# EAGLE schematic main (EAGLE 6.5.0)
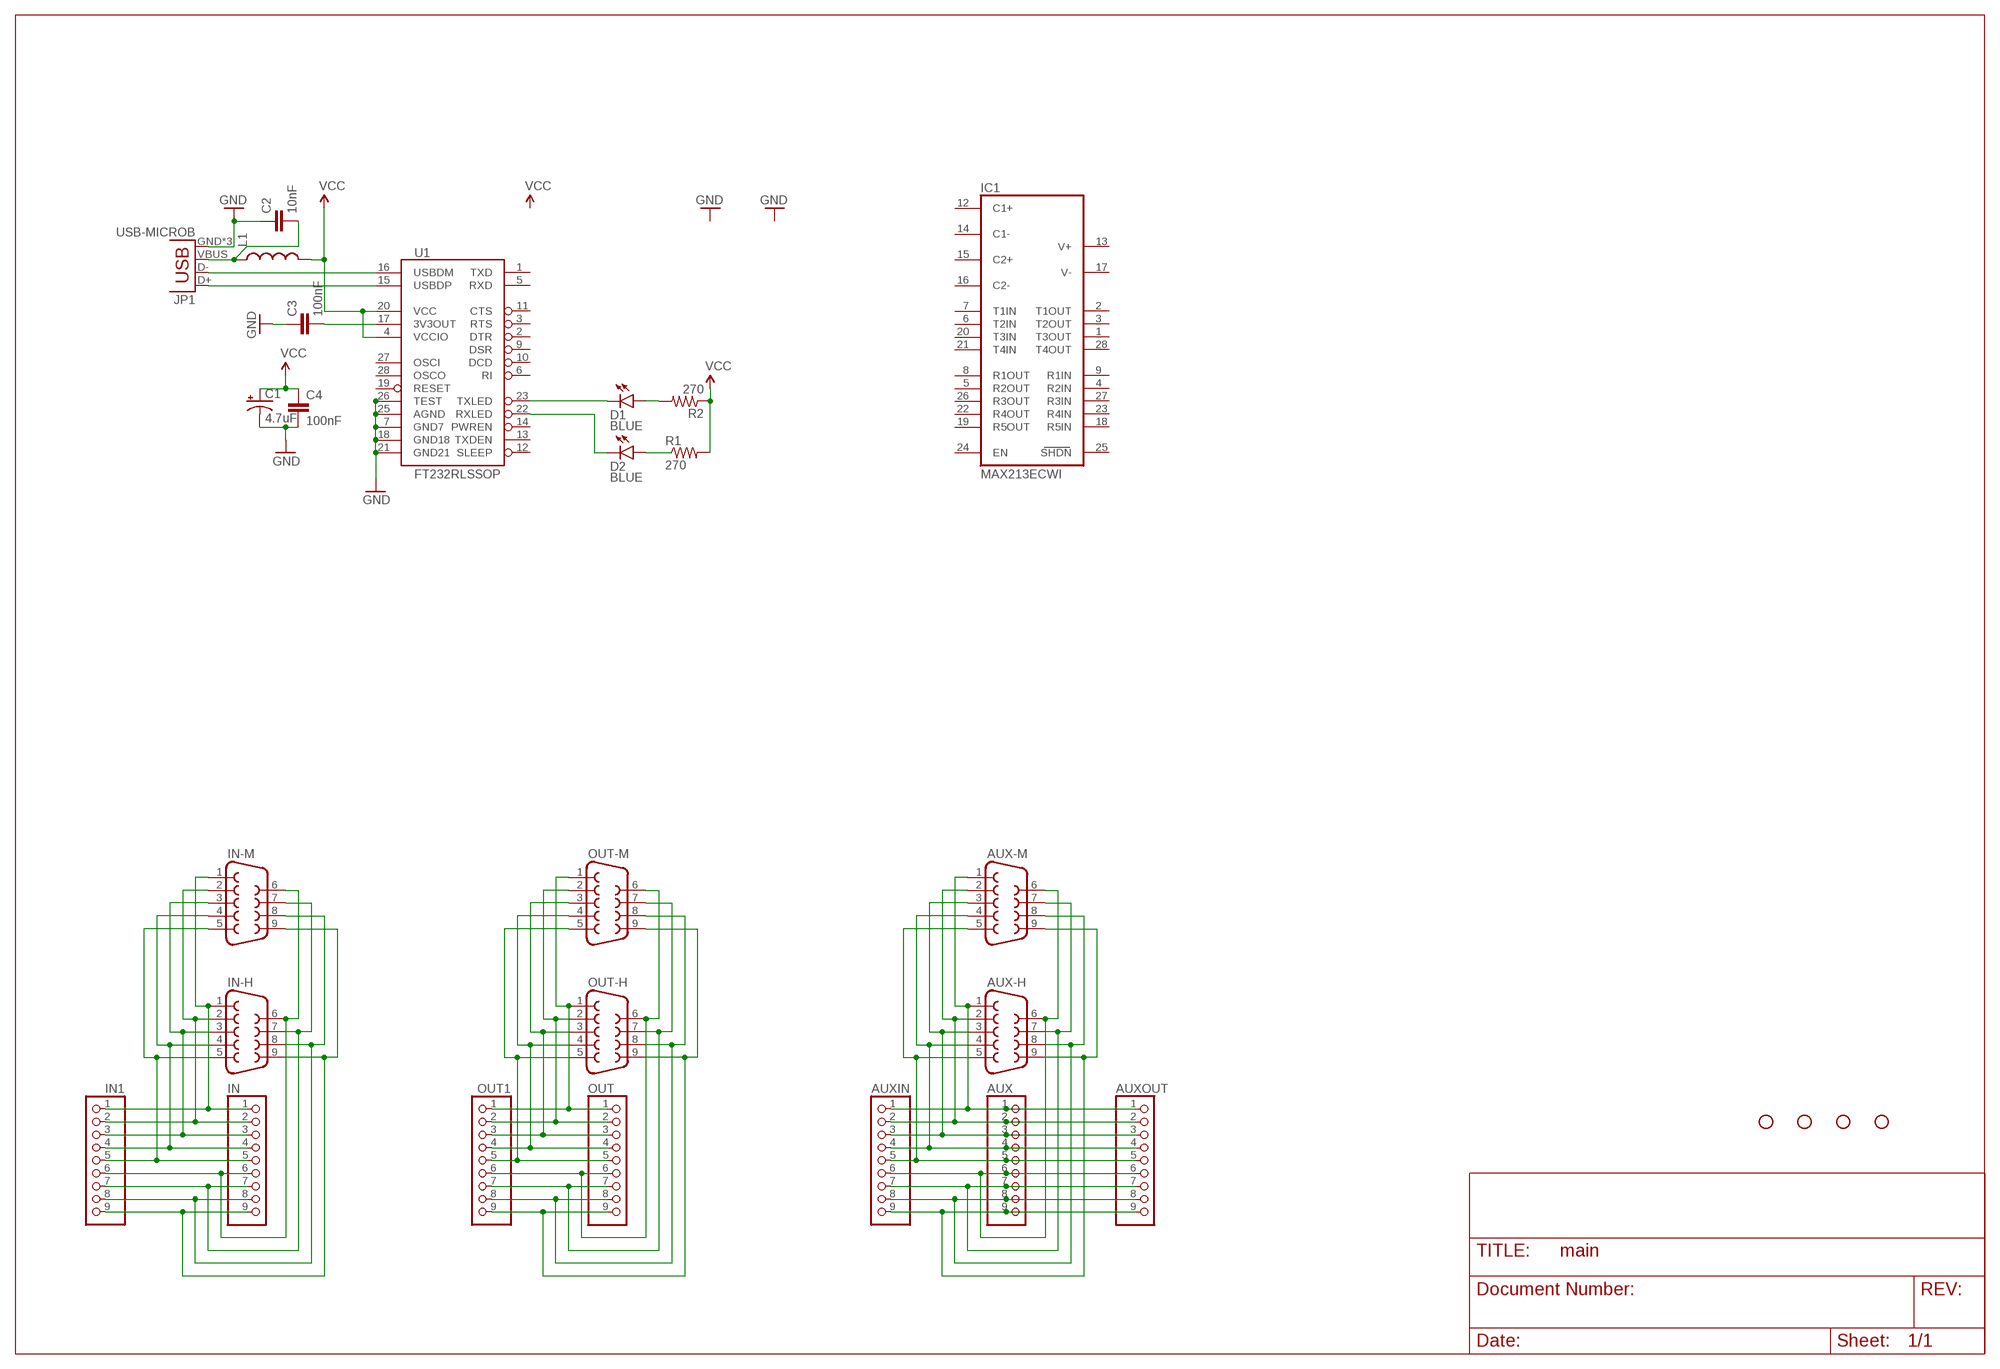
[diagram p0: schematic, sheet 1]

## Parts
AUX  PINHD-1X9  [1X09]
AUX-H  F09HP  [F09HP]
AUX-M  F09HP  [F09HP]
AUXIN  PINHD-1X9  [1X09]
AUXOUT  PINHD-1X9  [1X09]
C1  4.7uF  CAP_POL1206  [EIA3216]
C2  10nF  CAP0603-CAP  [0603-CAP]
C3  100nF  CAP0603-CAP  [0603-CAP]
C4  100nF  CAP0603-CAP  [0603-CAP]
D1  BLUE  LED-BLUE0603  [LED-0603]
D2  BLUE  LED-BLUE0603  [LED-0603]
IC1  MAX213ECWI  [SO28L]
IN  PINHD-1X9  [1X09]
IN1  PINHD-1X9  [1X09]
IN-H  F09HP  [F09HP]
IN-M  F09HP  [F09HP]
JP1  USB-MICROB  [USB-MICROB]
L1  INDUCTOR0603  [0603]
OUT  PINHD-1X9  [1X09]
OUT1  PINHD-1X9  [1X09]
OUT-H  F09HP  [F09HP]
OUT-M  F09HP  [F09HP]
R1  270  RESISTOR0603  [0603-RES]
R2  270  RESISTOR0603  [0603-RES]
STANDOFF1  STAND-OFF  [STAND-OFF]
STANDOFF2  STAND-OFF  [STAND-OFF]
STANDOFF3  STAND-OFF  [STAND-OFF]
STANDOFF4  STAND-OFF  [STAND-OFF]
U1  FT232RLSSOP  [SSOP28DB]

## Nets
GND: C1.C(-) C2.1 C3.1 C4.2 JP1.GND JP1.MT1(GND) JP1.MT2(GND) U1.7(GND7) U1.18(GND18) U1.21(GND21) U1.25(AGND) U1.26(TEST)
N$1: IN1.1 IN-H.1 IN-M.1 IN.1
N$2: IN1.2 IN-H.2 IN-M.2 IN.2
N$3: IN1.3 IN-H.3 IN-M.3 IN.3
N$4: IN1.4 IN-H.4 IN-M.4 IN.4
N$5: IN1.5 IN-H.5 IN-M.5 IN.5
N$6: IN1.6 IN-H.6 IN-M.6 IN.6
N$7: IN1.7 IN-H.7 IN-M.7 IN.7
N$8: IN1.8 IN-H.8 IN-M.8 IN.8
N$9: IN1.9 IN-H.9 IN-M.9 IN.9
N$10: OUT1.1 OUT-H.1 OUT-M.1 OUT.1
N$11: OUT1.2 OUT-H.2 OUT-M.2 OUT.2
N$12: OUT1.3 OUT-H.3 OUT-M.3 OUT.3
N$13: OUT1.4 OUT-H.4 OUT-M.4 OUT.4
N$14: OUT1.5 OUT-H.5 OUT-M.5 OUT.5
N$15: OUT1.6 OUT-H.6 OUT-M.6 OUT.6
N$16: OUT1.7 OUT-H.7 OUT-M.7 OUT.7
N$17: OUT1.8 OUT-H.8 OUT-M.8 OUT.8
N$18: OUT1.9 OUT-H.9 OUT-M.9 OUT.9
N$19: AUX-H.1 AUX-M.1 AUX.1 AUXIN.1 AUXOUT.1
N$20: AUX-H.2 AUX-M.2 AUX.2 AUXIN.2 AUXOUT.2
N$21: AUX-H.3 AUX-M.3 AUX.3 AUXIN.3 AUXOUT.3
N$22: AUX-H.4 AUX-M.4 AUX.4 AUXIN.4 AUXOUT.4
N$23: AUX-H.5 AUX-M.5 AUX.5 AUXIN.5 AUXOUT.5
N$24: AUX-H.6 AUX-M.6 AUX.6 AUXIN.6 AUXOUT.6
N$25: AUX-H.7 AUX-M.7 AUX.7 AUXIN.7 AUXOUT.7
N$26: AUX-H.8 AUX-M.8 AUX.8 AUXIN.8 AUXOUT.8
N$27: AUX-H.9 AUX-M.9 AUX.9 AUXIN.9 AUXOUT.9
N$28: JP1.D- U1.16(USBDM)
N$29: C2.2 JP1.VBUS L1.1
N$30: JP1.D+ U1.15(USBDP)
N$31: C3.2 U1.17(3V3OUT)
N$34: D1.A R2.2
N$35: D1.C U1.23(TXLED)
N$36: D2.C U1.22(RXLED)
N$37: D2.A
VCC: C1.A(+) C4.1 L1.2 R1.2 R2.1 U1.4(VCCIO) U1.20(VCC)
Unconnected: IC1.1(T3OUT) IC1.2(T1OUT) IC1.3(T2OUT) IC1.4(R2IN) IC1.5(R2OUT) IC1.6(T2IN) IC1.7(T1IN) IC1.8(R1OUT) IC1.9(R1IN) IC1.12(C1+) IC1.13(V+) IC1.14(C1-) IC1.15(C2+) IC1.16(C2-) IC1.17(V-) IC1.18(R5IN) IC1.19(R5OUT) IC1.20(T3IN) IC1.21(T4IN) IC1.22(R4OUT) IC1.23(R4IN) IC1.24(EN) IC1.25(SHDN) IC1.26(R3OUT) IC1.27(R3IN) IC1.28(T4OUT) R1.1 U1.1(TXD) U1.2(DTR) U1.3(RTS) U1.5(RXD) U1.6(RI) U1.9(DSR) U1.10(DCD) U1.11(CTS) U1.12(SLEEP) U1.13(TXDEN) U1.14(PWREN) U1.19(RESET) U1.27(OSCI) U1.28(OSCO)

## Power pins joined to a net without a drawn wire
GND: IC1.10(GND)
VCC: IC1.11(VCC)

## Library data of the parts
AUX AUXIN AUXOUT IN IN1 OUT OUT1 = pinhead:PINHD-1X9: PIN HEADER
AUX-H AUX-M IN-H IN-M OUT-H OUT-M = con-subd:F09: SUB-D; OC_FARNELL: unknown; OC_NEWARK: unknown
C1 = SparkFun-Passives:CAP_POL: Capacitor Polarized These are standard SMD and PTH capacitors. Normally 10uF, 47uF, and 100uF in electrolytic and tantalum varieties. Always verify the external diameter of the through hole cap, it varies with capacity, voltage, and manufacturer. The EIA devices should be standard.
C2-C4 = SparkFun-Capacitors:CAP: Capacitor Standard 0603 ceramic capacitor, and 0.1" leaded capacitor.
D1 D2 = SparkFun-LED:LED-BLUE: Blue LEDs for production use Various blue LEDs stocked by SparkFun production 0603 - DIO-08575 Rebel - DIO-09553 1206 - DIO-09911; PROD_ID: DIO-08575
IC1 = maxim:MAX213ECWI: RS232 TRANSCEIVER; MF: MAXIM; MPN: MAX213ECWI+; OC_FARNELL: unknown; OC_NEWARK: 23K5828
JP1 = SparkFun-Connectors:USB: USB Connectors USB-B-PTH is fully proven SKU : PRT-00139/CONN-08278 USB-miniB is fully proven SKU : PRT-00587 USB-A-PCB is untested. USB-A-H is throughly reviewed, but untested. Spark Fun Electronics SKU : PRT-00437 USB-B-SMT is throughly reviewed, but untested. Needs silkscreen touching up. USB-A-S has not been used/tested USB-MB-H has not been used/tested USB-MICROB has been used. CONN-09505; PROD_ID: CONN-09505
L1 = SparkFun-Passives:INDUCTOR: Inductors Basic Inductor/Choke - 0603 and 1206. Footprints are not proven and vary greatly between part numbers. SRN6045- 33uH, 20% 1.4A SDR0403-560KL - 56uH, 10%, 500mA RMS/740mA peak
R1 R2 = SparkFun-Resistors:RESISTOR: Resistor Basic schematic elements and footprints for 0603, 1206, and PTH resistors.
STANDOFF1-STANDOFF4 = SparkFun-Electromechanical:STAND-OFF: #4 Stand Off This is the mechanical footprint for a #4 phillips button head screw. Use the keepout ring to avoid running the screw head into surrounding components. SKU : PRT-00447
U1 = SparkFun-DigitalIC:FT232RL: USB UART FT232RL 4th Generation USB UART (USB <-> Serial) Controller. Spark Fun Electronics SKU : COM-00650 Production SKU IC-00870; PROD_ID: IC-00870